# Altium schematic sheet conductivity.SchDoc
size A4
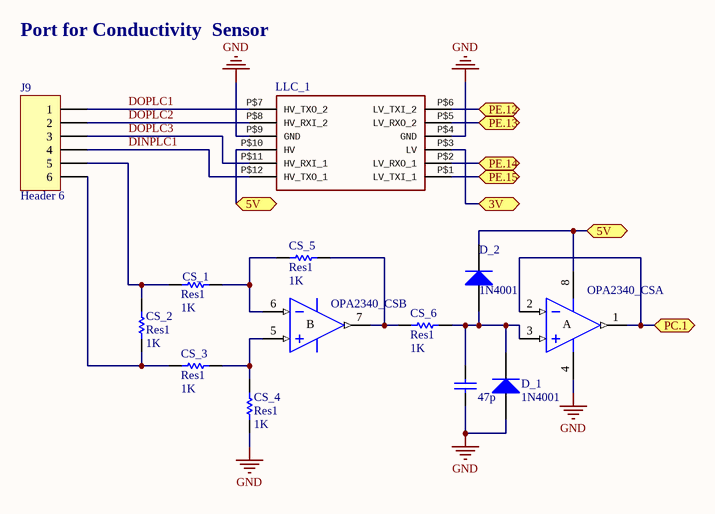
[diagram p0: conductivity.SchDoc]

## Parts
47p  Cap  [My_cap100n]  (value not drawn)
CS_1  Res1  value 1K  [AXIAL-0.3]
CS_2  Res1  value 1K  [AXIAL-0.3]
CS_3  Res1  value 1K  [AXIAL-0.3]
CS_4  Res1  value 1K  [AXIAL-0.3]
CS_5  Res1  value 1K  [AXIAL-0.3]
CS_6  Res1  value 1K  [AXIAL-0.3]
D_1  1N4001  [DO-41]
D_2  1N4001  [DO-41]
J9  Header 6  [HDR1X6]
LLC_1  Logic Level Converter (3.3v - 5v) / https://www.sparkfun.com/products/8745  [LOGIC_LEVEL_CONVERTER]  (value not drawn)
OPA2340_CS  LM358P  [P008]  (value not drawn)  (parts A,B of 2)

## Ports
3V, 5V, PC.1, PE.12, PE.13, PE.14, PE.15

## Nets
GND: 47p.1 CS_4.1 D_1.1(A) LLC_1.P$4(GND) LLC_1.P$9(GND) OPA2340_CS.4(V-)
3V: LLC_1.P$3(LV) ; port 3V
5V: D_2.2(K) LLC_1.P$10(HV) OPA2340_CS.8(V+) ; port 5V
DINPLC1: J9.4 LLC_1.P$12(HV_TXO_1)
DOPLC1: J9.1 LLC_1.P$7(HV_TXO_2)
DOPLC2: J9.2 LLC_1.P$8(HV_RXI_2)
DOPLC3: J9.3 LLC_1.P$11(HV_RXI_1)
PC.1: OPA2340_CS.1(OUT) OPA2340_CS.2(IN-) ; port PC.1
PE.12: LLC_1.P$6(LV_TXI_2) ; port PE.12
PE.13: LLC_1.P$5(LV_RXO_2) ; port PE.13
PE.14: LLC_1.P$2(LV_RXO_1) ; port PE.14
PE.15: LLC_1.P$1(LV_TXI_1) ; port PE.15
Net47p_2: 47p.2 CS_6.2 D_1.2(K) D_2.1(A) OPA2340_CS.3(IN+)
NetCS_1_1: CS_1.1 CS_2.2 J9.5
NetCS_1_2: CS_1.2 CS_5.1 OPA2340_CS.6(IN-)
NetCS_2_1: CS_2.1 CS_3.1 J9.6
NetCS_3_2: CS_3.2 CS_4.2 OPA2340_CS.5(IN+)
NetCS_5_2: CS_5.2 CS_6.1 OPA2340_CS.7(OUT)

## Notes on the sheet
- Port for Conductivity  Sensor
- (in symbol LM358P, part A) A
- (in symbol LM358P, part B) B

## Library data of the parts
47p = Cap ceramic: CAP-100Nf; Value: 100nF
CS_1-CS_6 = Res1: Resistor; Published: 8-Jun-2000; LatestRevisionDate: 17-Jul-2002; LatestRevisionNote: Re-released for DXP Platform.; PackageReference: AXIAL-0.3; Publisher: Altium Limited; PackageDescription: Axial Device, Thru-Hole; 2 Leads; 0.3 in Pin Spacing
D_1 D_2 = Diode 1N4001: 1 Amp General Purpose Rectifier; Published: 8-Jun-2000; LatestRevisionDate: 17-Jul-2002; LatestRevisionNote: Re-released for DXP Platform.; DatasheetVersion: 1998; PackageVersion: Aug-1999; PackageReference: DO-41; Publisher: Altium Limited; PackageDescription: Diode, Axial; Body 5.2 x 2.7 mm (LxDia. max), Lead Dia. 0.86 mm (max); Code_JEDEC: DO-204-AL; ComponentLink1Description: Manufacturer Link; ComponentLink1URL: http://www.fairchildsemi.com/; ComponentLink2Description: Datasheet; ComponentLink2URL: http://www.fairchildsemi.com/ds/1N%2F1N4001.pdf
J9 = Header 6: Header, 6-Pin; LatestRevisionDate: 17-Jul-2002; LatestRevisionNote: Re-released for DXP Platform.; Publisher: Altium Limited
LLC_1 = LOGIC_LEVEL_CONVERTER
OPA2340_CS = LM358P: Dual Operational Amplifier; Published: 16-Jan-2001; LatestRevisionDate: 04-Mar-2005; LatestRevisionNote: Stylized 3D Model Added.; DatasheetVersion: Jul-1998; PackageVersion: Jun-1999; PackageReference: P008; Publisher: Altium Limited; PackageDescription: DIP; 8 Leads; Row Spacing 7.62 mm; Pitch 2.54 mm; Code_JEDEC: MO-001-AN; ComponentLink1Description: Manufacturer Link; ComponentLink1URL: http://www.ti.com/; ComponentLink2Description: Datasheet; ComponentLink2URL: http://www-s.ti.com/sc/ds/lm358.pdf